# Altium schematic sheet Microcontroller.SchDoc: Sheetname
size A4; Organization: Thomas More: Embedded IT; Address1: Robbe Van Assche; Address2: Belgium; Address3: 2015; Address4: Proof Of Concept: An Analog Datalogger; DocumentNumber: ALT0061; Revision: A; SheetNumber: 1; SheetTotal: 4
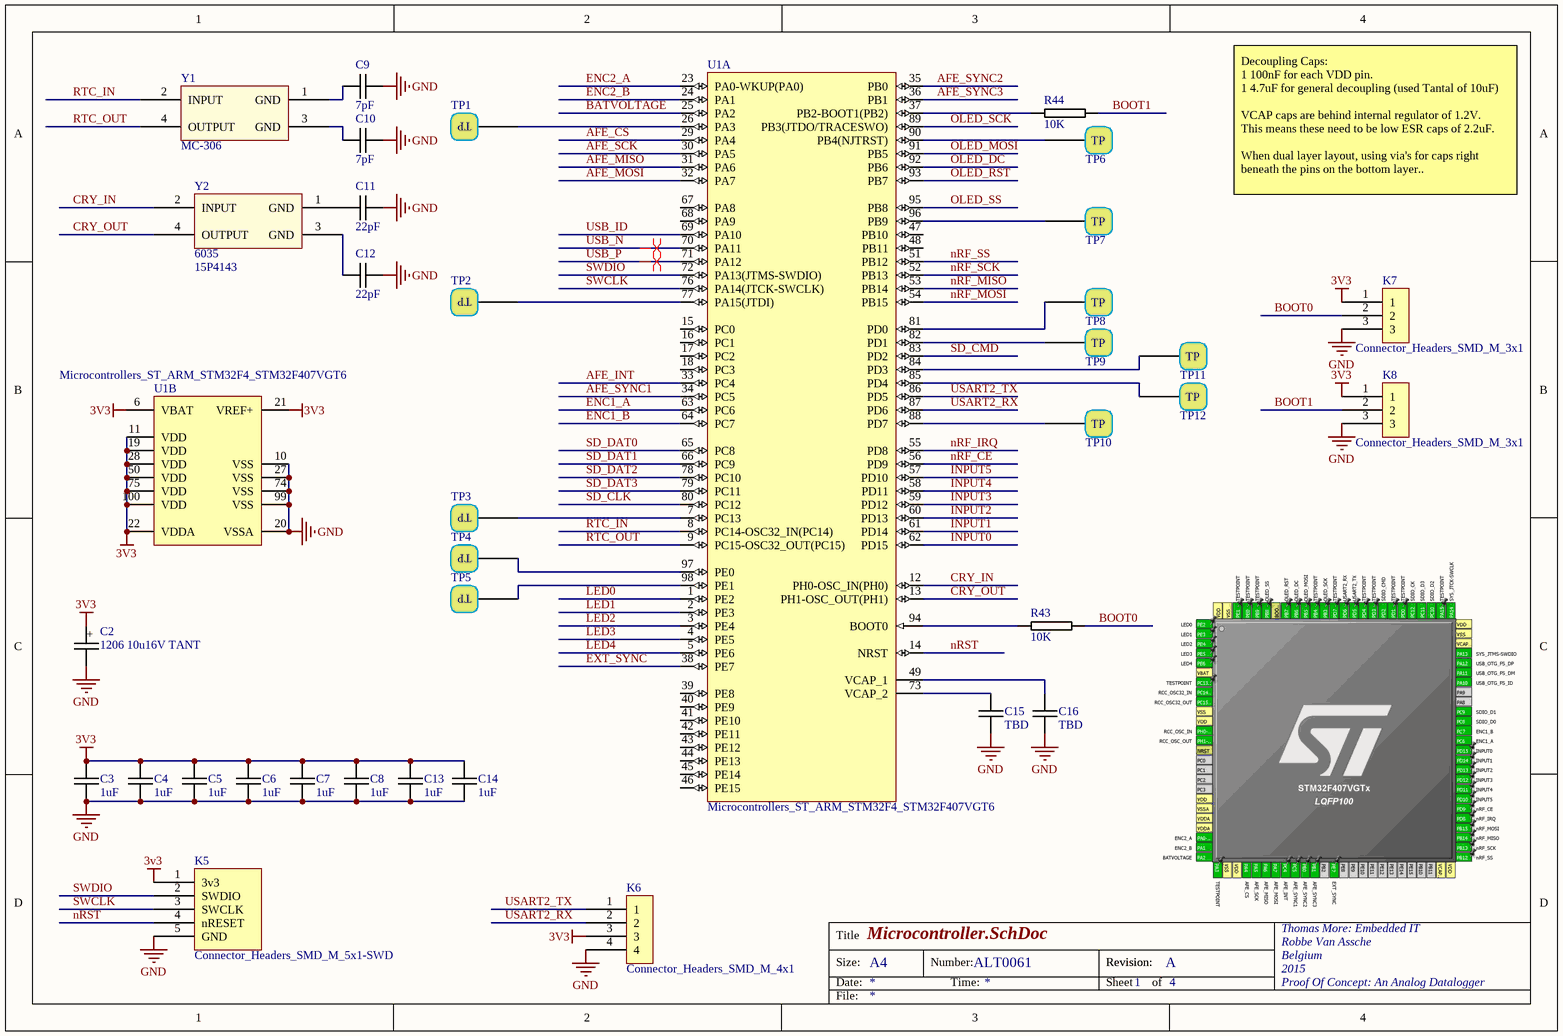
[diagram p0: Microcontroller.SchDoc]

## Parts
C2  1206 10u16V TANT  [1206C+_TANTAL-10u16V]
C3  1uF  [0402C-GENERIC]
C4  1uF  [0402C-GENERIC]
C5  1uF  [0402C-GENERIC]
C6  1uF  [0402C-GENERIC]
C7  1uF  [0402C-GENERIC]
C8  1uF  [0402C-GENERIC]
C9  7pF  [0603C-GENERIC]
C10  7pF  [0603C-GENERIC]
C11  22pF  [0603C-GENERIC]
C12  22pF  [0603C-GENERIC]
C13  1uF  [0402C-GENERIC]
C14  1uF  [0402C-GENERIC]
C15  TBD  [1210C-GENERIC]
C16  TBD  [1210C-GENERIC]
K5  Connector_Headers_SMD_M_5x1-SWD  [Header_Male_2.54 5x1]
K6  Connector_Headers_SMD_M_4x1  [Header_Male_2.54 4x1]
K7  Connector_Headers_SMD_M_3x1  [Header_Male_2.54 3x1]
K8  Connector_Headers_SMD_M_3x1  [Header_Male_2.54 3x1]
R43  10K  [0805R-10K]
R44  10K  [0805R-10K]
TP1  Connector_Production Connectors_SMD_TESTPOINT  [TESTPOINT]  (value not drawn)
TP2  Connector_Production Connectors_SMD_TESTPOINT  [TESTPOINT]  (value not drawn)
TP3  Connector_Production Connectors_SMD_TESTPOINT  [TESTPOINT]  (value not drawn)
TP4  Connector_Production Connectors_SMD_TESTPOINT  [TESTPOINT]  (value not drawn)
TP5  Connector_Production Connectors_SMD_TESTPOINT  [TESTPOINT]  (value not drawn)
TP6  Connector_Production Connectors_SMD_TESTPOINT  [TESTPOINT]  (value not drawn)
TP7  Connector_Production Connectors_SMD_TESTPOINT  [TESTPOINT]  (value not drawn)
TP8  Connector_Production Connectors_SMD_TESTPOINT  [TESTPOINT]  (value not drawn)
TP9  Connector_Production Connectors_SMD_TESTPOINT  [TESTPOINT]  (value not drawn)
TP10  Connector_Production Connectors_SMD_TESTPOINT  [TESTPOINT]  (value not drawn)
TP11  Connector_Production Connectors_SMD_TESTPOINT  [TESTPOINT]  (value not drawn)
TP12  Connector_Production Connectors_SMD_TESTPOINT  [TESTPOINT]  (value not drawn)
U1  Microcontrollers_ST_ARM_STM32F4_STM32F407VGT6  [STM-LQFP100_N]  (parts A,B of 2)
Y1  MC-306  [XTAL MC-306]
Y2  6035  Supplier Part Number 1: 15P4143  [XTAL 6035]

## Nets
3v3: C2.1 C3.1 C4.1 C5.1 C6.1 C7.1 C8.1 C13.1 C14.1 K5.1(3v3) K6.3 K7.1 K8.1 U1.6(VBAT) U1.11(VDD) U1.19(VDD) U1.21(VREF+) U1.22(VDDA) U1.28(VDD) U1.50(VDD) U1.75(VDD) U1.100(VDD)
GND: C2.2 C3.2 C4.2 C5.2 C6.2 C7.2 C8.2 C9.2 C10.2 C11.2 C12.2 C13.2 C14.2 C15.2 C16.2 K5.5(GND) K6.4 K7.3 K8.3 U1.10(VSS) U1.20(VSSA) U1.27(VSS) U1.74(VSS) U1.99(VSS)
AFE_CS: U1.29(PA4)
AFE_INT: U1.33(PC4)
AFE_MISO: U1.31(PA6)
AFE_MOSI: U1.32(PA7)
AFE_SCK: U1.30(PA5)
AFE_SYNC1: U1.34(PC5)
AFE_SYNC2: U1.35(PB0)
AFE_SYNC3: U1.36(PB1)
BATVOLTAGE: U1.25(PA2)
BOOT0: K7.2 R43.2
BOOT1: K8.2 R44.2
CRY_IN: U1.12(PH0-OSC_IN(PH0)) Y2.2(INPUT)
CRY_OUT: U1.13(PH1-OSC_OUT(PH1)) Y2.4(OUTPUT)
ENC1_A: U1.63(PC6)
ENC1_B: U1.64(PC7)
ENC2_A: U1.23(PA0-WKUP(PA0))
ENC2_B: U1.24(PA1)
EXT_SYNC: U1.38(PE7)
INPUT0: U1.62(PD15)
INPUT1: U1.61(PD14)
INPUT2: U1.60(PD13)
INPUT3: U1.59(PD12)
INPUT4: U1.58(PD11)
INPUT5: U1.57(PD10)
LED0: U1.1(PE2)
LED1: U1.2(PE3)
LED2: U1.3(PE4)
LED3: U1.4(PE5)
LED4: U1.5(PE6)
nRF_CE: U1.56(PD9)
nRF_IRQ: U1.55(PD8)
nRF_MISO: U1.53(PB14)
nRF_MOSI: U1.54(PB15)
nRF_SCK: U1.52(PB13)
nRF_SS: U1.51(PB12)
nRST: K5.4(nRESET) U1.14(NRST)
OLED_DC: U1.92(PB6)
OLED_MOSI: U1.91(PB5)
OLED_RST: U1.93(PB7)
OLED_SCK: U1.89(PB3(JTDO/TRACESWO))
OLED_SS: U1.95(PB8)
RTC_IN: U1.8(PC14-OSC32_IN(PC14)) Y1.2(INPUT)
RTC_OUT: U1.9(PC15-OSC32_OUT(PC15)) Y1.4(OUTPUT)
SD_CLK: U1.80(PC12)
SD_CMD: U1.83(PD2)
SD_DAT0: U1.65(PC8)
SD_DAT1: U1.66(PC9)
SD_DAT2: U1.78(PC10)
SD_DAT3: U1.79(PC11)
SWCLK: K5.3(SWCLK) U1.76(PA14(JTCK-SWCLK))
SWDIO: K5.2(SWDIO) U1.72(PA13(JTMS-SWDIO))
USART2_RX: K6.2 U1.87(PD6)
USART2_TX: K6.1 U1.86(PD5)
USB_ID: U1.69(PA10)
USB_N: U1.70(PA11)
USB_P: U1.71(PA12)
NetC9_1: C9.1 Y1.1(GND)
NetC10_1: C10.1 Y1.3(GND)
NetC11_1: C11.1 Y2.1(GND)
NetC12_1: C12.1 Y2.3(GND)
NetC15_1: C15.1 U1.73(VCAP_2)
NetC16_1: C16.1 U1.49(VCAP_1)
NetR43_1: R43.1 U1.94(BOOT0)
NetR44_1: R44.1 U1.37(PB2-BOOT1(PB2))
NetTP1_1: TP1.1(TESTPIN) U1.26(PA3)
NetTP2_1: TP2.1(TESTPIN) U1.77(PA15(JTDI))
NetTP3_1: TP3.1(TESTPIN) U1.7(PC13)
NetTP4_1: TP4.1(TESTPIN) U1.97(PE0)
NetTP5_1: TP5.1(TESTPIN) U1.98(PE1)
NetTP6_1: TP6.1(TESTPIN) U1.90(PB4(NJTRST))
NetTP7_1: TP7.1(TESTPIN) U1.96(PB9)
NetTP8_1: TP8.1(TESTPIN) U1.81(PD0)
NetTP9_1: TP9.1(TESTPIN) U1.82(PD1)
NetTP10_1: TP10.1(TESTPIN) U1.88(PD7)
NetTP11_1: TP11.1(TESTPIN) U1.84(PD3)
NetTP12_1: TP12.1(TESTPIN) U1.85(PD4)

Not connected (* = marked no-connect by the designer): U1 15(PC0) 16(PC1) 17(PC2) 18(PC3) 39(PE8) 40(PE9) 41(PE10) 42(PE11) 43(PE12) 44(PE13) 45(PE14) 46(PE15) 47(PB10) 48(PB11) 67(PA8) 68(PA9)

## Layout directives
differential pair: USB_N, USB_P

## Notes on the sheet
- Decoupling Caps:
  1 100nF for each VDD pin.
  1 4.7uF for general decoupling (used Tantal of 10uF)
  VCAP caps are behind internal regulator of 1.2V.
  This means these need to be low ESR caps of 2.2uF.
  When dual layer layout, using via's for caps right beneath the pins on the bottom layer..
- Title
- Size:
- Date:
- A4
- Number:
- Time:
- Revision:
- Sheet
- of
- File:
- (in symbol Connector_Production Connectors_SMD_TESTPOINT) TP
- (in symbol Passives_Capacitors_Tantalum_1206C-TANTAL SIZE A-10u16V) +

## Library data of the parts
C2 = Passives_Capacitors_Tantalum_1206C-TANTAL SIZE A-10u16V
C3-C8 C13 C14 = Passives_Capacitors_0402_1UF-10V-X5R-SAM: CAPACITOR 0402 CERAMIC; Reel: C18
C9 C10 = Passives_Capacitors_0603_6N850V-X7R-MUR: CAPACITOR 0603 CERAMIC; Manufacturer: Murata Electronics North America; Manufacturer Part Number: GRM188R71H682KA01D; Reel: C35; Supplier 1: Digi-Key; Supplier Part Number 1: 490-1508-2-ND
C11 C12 = Passives_Capacitors_0603_22PF-50V-C0G-PAN: CAPACITOR 0603 CERAMIC; Manufacturer Part Number: ECJ-1VC1H220J; Manufacturer: Panasonic - ECG; Reel: C10; Tolerance: ±5%; Temperature Coefficient: C0G, NP0; Voltage - Rated: 50V; Supplier 1: Digi-Key; Features: General Purpose; Lead Spacing: -; Supplier: Digi-Key; Capacitance: 22pF; Packaging: Tape & Reel (TR); Mounting Type: Surface Mount, MLCC; RoHS: RoHS Compliant; Operating Temperature: -55°C ~ 125°C; Thickness: 0.80mm; Package / Case: 0603 (1608 metric); Category: Capacitors; Supplier Part Number 1: PCC220ACVTR-ND; Supplier Part Number: PCC220ACVTR-ND
C15 C16 = Passives_Capacitors_1210_1210C-TBD: CAPACITOR 1210 CERAMIC VALUE TO BE DETERMINED
K5 = Connector_Headers_SMD_M_5x1-SWD: SWD SMD Header 5x1 for STM32
K6 = Connector_Headers_SMD_M_4x1: SMD Header 4x1
K7 K8 = Connector_Headers_SMD_M_3x1: SMD Header 3x1
R43 R44 = 0805R-10K: RESISTOR 0805 1/4 WATT THIN FILM; Reel: *
U1 = Microcontrollers_ST_ARM_STM32F4_STM32F407VGT6: ARM Cortex-M4 32-bit MCU+FPU, 210 DMIPS, 1024 kB Flash, 192 kB Internal RAM, 82 I/Os, 100-pin LQFP, -40 to 85 degC, Tray; Manufacturer: STMicroelectronics; D/A Converter: 2x12-bit; FLASH Size (Prog) (kB): 1024; I/Os (High Current): 82; Internal RAM Size (kB): 192; Operating Frequency(F) (Processor speed) (MHz): 168; Supply Voltage(Vcc) max (V): 3.6; Supply Voltage(Vcc) min (V): 1.8; DatasheetVersion: Rev. 4; PackageVersion: Rev. 1, 06/2013; PackageReference: LQFP100; PackageDescription: 100-Pin Low Profile Quad Flat Package, 14 x 14 mm Body, 0.5 mm Pitch; Supplier 1: Digi-Key; Supplier Part Number 1: 497-11605-ND; Supplier 2: Farnell; Supplier Part Number 2: 2064368; Supplier 3: Newark; Supplier Part Number 3: 73T2333; Supplier 4: Mouser; Supplier Part Number 4: 511-STM32F407VGT6; Core: ARM Cortex-M4; Packing: Tray; Mounting Technology: Surface Mount; PartNumber: STM32F407VGT6; ComponentLink1Description: Manufacturer URL; ComponentLink1URL: http://www.st.com/web/en/home.html; ComponentLink2Description: Datasheet; ComponentLink2URL: http://www.st.com/st-web-ui/static/active/en/resource/technical/document/datasheet/DM00037051.pdf; ComponentLink3Description: Package Specification; ComponentLink3URL: http://www.st.com/st-web-ui/static/active/en/resource/technical/document/data_brief/DM00071938.pdf
Y1 = 32k Quartz
Y2 = 6035 Quartz: Supplier 1: Newark